# Altium schematic sheet DAC+ADC_MAX5841+MAX1037.SchDoc: 4-Ch I2C 10-Bit DAC & 8-Bit ADC
size A4; Organization: Altium Limited.; Address1: Level 3, 12a Rodborough Rd; Address2: Frenchs Forest 2086; Address3: NSW; Address4: AUSTRALIA; Revision: 6; SheetNumber: 39; SheetTotal: 64
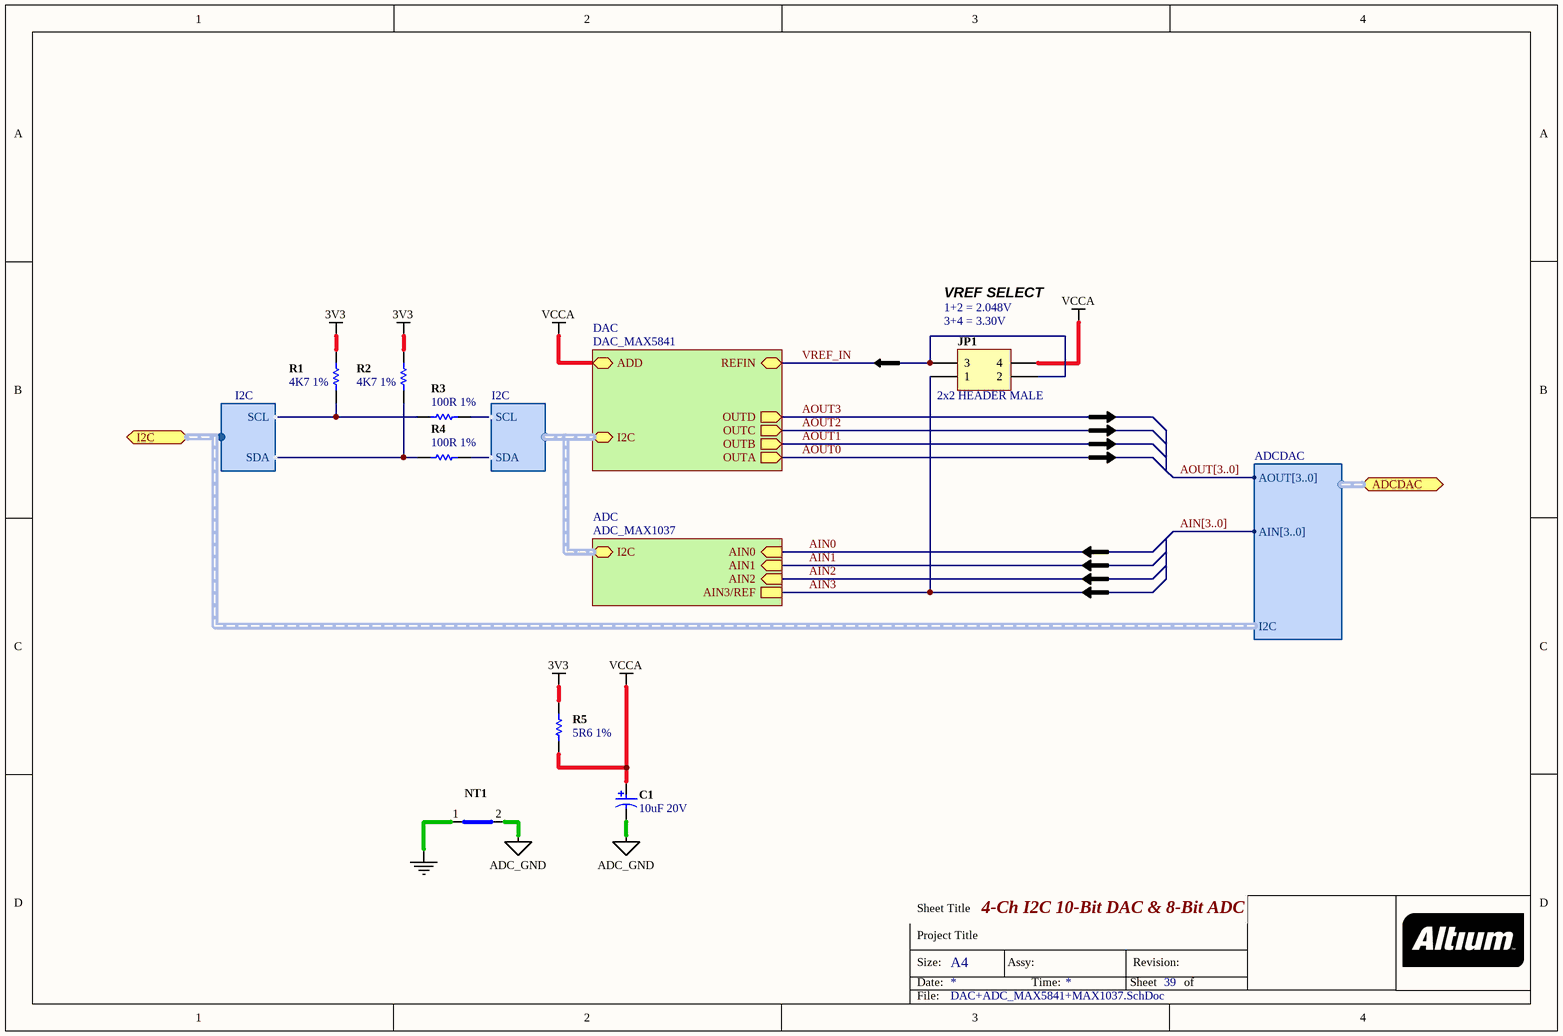
[diagram p0: DAC+ADC_MAX5841+MAX1037.SchDoc]

## Parts
C1  10uF 20V  [CAPC3528-STAR]
JP1  2x2 HEADER MALE  [HDR2X2]
NT1  Net Tie SMT2  [NETTIE-SMT2-16X11]  (value not drawn)  (net tie, no BOM)
R1  4K7 1%  [RESC1005-STAR]
R2  4K7 1%  [RESC1005-STAR]
R3  100R 1%  [RESC1005-STAR]
R4  100R 1%  [RESC1005-STAR]
R5  5R6 1%  [RESC1005-STAR]

## Sub-sheets
ADC = ADC_MAX1037: I2C (harness I2C), AIN0 (in), AIN1 (in), AIN2 (in), AIN3/REF
DAC = DAC_MAX5841: I2C (harness I2C), OUTD (out), OUTC (out), OUTB (out), OUTA (out), REFIN (bidir), ADD (bidir)

## Ports
ADCDAC (harness ADCDAC), I2C (harness I2C)

## Harnesses
I2C: SCL, SDA
ADCDAC: AIN[3..0], AOUT[3..0], I2C

## Nets
3V3: R1.1 R2.1 R5.2
ADC_GND: C1.2 NT1.2(Net2)
GND: NT1.1(Net1)
VCCA: C1.1 JP1.4 R5.1 ; sheet DAC/ADD
AIN0: sheet ADC/AIN0
AIN1: sheet ADC/AIN1
AIN2: sheet ADC/AIN2
AIN3: JP1.1 ; sheet ADC/AIN3/REF
AOUT0: sheet DAC/OUTA
AOUT1: sheet DAC/OUTB
AOUT2: sheet DAC/OUTC
AOUT3: sheet DAC/OUTD
VREF_IN: JP1.2 JP1.3 ; sheet DAC/REFIN
NetR1_2: R1.2 R3.1 ; port I2C.SCL
NetR2_2: R2.2 R4.1 ; port I2C.SDA
NetR3_2: R3.2 ; sheet DAC/I2C.SCL
NetR4_2: R4.2 ; sheet DAC/I2C.SDA

## Buses and harness runs
bus AIN[3..0]
bus AOUT[3..0]
harness sheet ADC/I2C = sheet DAC/I2C

## Notes on the sheet
- VREF SELECT
- (near JP1) 1+2 = 2.048V
- (near JP1) 3+4 = 3.30V
- Sheet Title
- Project Title
- Size:
- Date:
- A4
- Assy:
- Time:
- Sheet
- Revision:
- of
- File:

## Library data of the parts
C1 = D-101-0007: Capacitor, Tantalum, 10uF 10% 20V MCCT-B (3528); Polarity: Polarized; Category: Capacitor; Capacitance: 10 uF; Mounting Technology: Surface Mount; Rated Voltage: 20 V; Status: Production; Technology: Tantalum; Tolerance: 10 %
JP1 = D-300-0019: Header IDC, 2 x 2 Pin Vertical 2.54mm Pitch (Non-Boxed, Male); Max Current: 3 A; Category: Connector; Connector type: Header; Mounting Technology: Through-Hole; Pin Count: 4; Status: Production
NT1 = D-002-0006: Net-Tie, Surface Mount, 2 x 0.8mm x 0.4mm SMT Pads - For 0.4mm Track; Category: Net-Tie; Status: Production
R1 R2 = D-100-0088: Resistor, 4K7 1% 0402 (1005); Power Rating: 63 mW; Resistance: 4.7 K; Category: Resistor; Mounting Technology: Surface Mount; Status: Production; Tolerance: 1 %
R3 R4 = D-100-0131: Resistor, 100R 1% 0402 (1005); Power Rating: 63 mW; Category: Resistor; Mounting Technology: Surface Mount; Resistance: 100 R; Status: Production; Tolerance: 1 %
R5 = D-100-0085: Resistor, 5R6 1% 0402 (1005); Power Rating: 63 mW; Resistance: 5.6 R; Category: Resistor; Mounting Technology: Surface Mount; Status: Production; Tolerance: 1 %